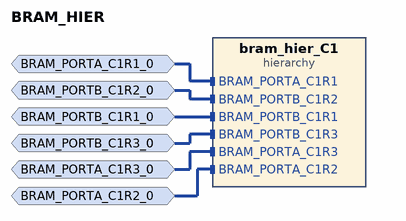
[diagram p0: block diagram of the top level]
# Vivado block design BRAM_HIER, xc7z020clg400-1, Vivado 2020.1
create_bd_design BRAM_HIER

create_bd_intf_port -mode Slave -vlnv xilinx.com:interface:bram_rtl:1.0 BRAM_PORTA_C1R1_0
set_property -dict {CONFIG.READ_WRITE_MODE READ_WRITE} [get_bd_intf_ports BRAM_PORTA_C1R1_0]
create_bd_intf_port -mode Slave -vlnv xilinx.com:interface:bram_rtl:1.0 BRAM_PORTA_C1R2_0
set_property -dict {CONFIG.READ_WRITE_MODE READ_WRITE} [get_bd_intf_ports BRAM_PORTA_C1R2_0]
create_bd_intf_port -mode Slave -vlnv xilinx.com:interface:bram_rtl:1.0 BRAM_PORTA_C1R3_0
set_property -dict {CONFIG.READ_WRITE_MODE READ_WRITE} [get_bd_intf_ports BRAM_PORTA_C1R3_0]
create_bd_intf_port -mode Slave -vlnv xilinx.com:interface:bram_rtl:1.0 BRAM_PORTB_C1R1_0
set_property -dict {CONFIG.READ_WRITE_MODE READ_WRITE} [get_bd_intf_ports BRAM_PORTB_C1R1_0]
create_bd_intf_port -mode Slave -vlnv xilinx.com:interface:bram_rtl:1.0 BRAM_PORTB_C1R2_0
set_property -dict {CONFIG.READ_WRITE_MODE READ_WRITE} [get_bd_intf_ports BRAM_PORTB_C1R2_0]
create_bd_intf_port -mode Slave -vlnv xilinx.com:interface:bram_rtl:1.0 BRAM_PORTB_C1R3_0
set_property -dict {CONFIG.READ_WRITE_MODE READ_WRITE} [get_bd_intf_ports BRAM_PORTB_C1R3_0]

create_bd_cell -type hier bram_hier_C1

# ---- hierarchy /bram_hier_C1 ----
current_bd_instance /bram_hier_C1
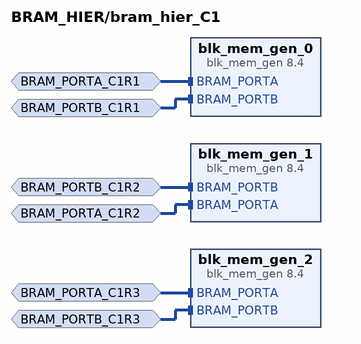
[diagram p1: block diagram inside /bram_hier_C1]
create_bd_intf_pin -mode Slave -vlnv xilinx.com:interface:bram_rtl:1.0 BRAM_PORTA_C1R1
create_bd_intf_pin -mode Slave -vlnv xilinx.com:interface:bram_rtl:1.0 BRAM_PORTB_C1R1
create_bd_intf_pin -mode Slave -vlnv xilinx.com:interface:bram_rtl:1.0 BRAM_PORTA_C1R2
create_bd_intf_pin -mode Slave -vlnv xilinx.com:interface:bram_rtl:1.0 BRAM_PORTB_C1R2
create_bd_intf_pin -mode Slave -vlnv xilinx.com:interface:bram_rtl:1.0 BRAM_PORTA_C1R3
create_bd_intf_pin -mode Slave -vlnv xilinx.com:interface:bram_rtl:1.0 BRAM_PORTB_C1R3

create_bd_cell -type ip -vlnv xilinx.com:ip:blk_mem_gen:8.4 blk_mem_gen_0
set_property -dict [list \
  CONFIG.Enable_32bit_Address false \
  CONFIG.Enable_B Use_ENB_Pin \
  CONFIG.Memory_Type True_Dual_Port_RAM \
  CONFIG.Port_B_Clock 100 \
  CONFIG.Port_B_Enable_Rate 100 \
  CONFIG.Port_B_Write_Rate 50 \
  CONFIG.Register_PortA_Output_of_Memory_Primitives true \
  CONFIG.Register_PortB_Output_of_Memory_Primitives true \
  CONFIG.Use_Byte_Write_Enable false \
  CONFIG.Use_RSTA_Pin false \
  CONFIG.Write_Depth_A 1800 \
  CONFIG.use_bram_block Stand_Alone \
] [get_bd_cells blk_mem_gen_0]
create_bd_cell -type ip -vlnv xilinx.com:ip:blk_mem_gen:8.4 blk_mem_gen_1
set_property -dict [list \
  CONFIG.Enable_32bit_Address false \
  CONFIG.Enable_B Use_ENB_Pin \
  CONFIG.Memory_Type True_Dual_Port_RAM \
  CONFIG.Port_B_Clock 100 \
  CONFIG.Port_B_Enable_Rate 100 \
  CONFIG.Port_B_Write_Rate 50 \
  CONFIG.Register_PortA_Output_of_Memory_Primitives true \
  CONFIG.Register_PortB_Output_of_Memory_Primitives true \
  CONFIG.Use_Byte_Write_Enable false \
  CONFIG.Use_RSTA_Pin false \
  CONFIG.Write_Depth_A 1800 \
  CONFIG.use_bram_block Stand_Alone \
] [get_bd_cells blk_mem_gen_1]
create_bd_cell -type ip -vlnv xilinx.com:ip:blk_mem_gen:8.4 blk_mem_gen_2
set_property -dict [list \
  CONFIG.Enable_32bit_Address false \
  CONFIG.Enable_B Use_ENB_Pin \
  CONFIG.Memory_Type True_Dual_Port_RAM \
  CONFIG.Port_B_Clock 100 \
  CONFIG.Port_B_Enable_Rate 100 \
  CONFIG.Port_B_Write_Rate 50 \
  CONFIG.Register_PortA_Output_of_Memory_Primitives true \
  CONFIG.Register_PortB_Output_of_Memory_Primitives true \
  CONFIG.Use_Byte_Write_Enable false \
  CONFIG.Use_RSTA_Pin false \
  CONFIG.Write_Depth_A 1800 \
  CONFIG.use_bram_block Stand_Alone \
] [get_bd_cells blk_mem_gen_2]

# ---- connections ----

current_bd_instance /bram_hier_C1
connect_bd_intf_net [get_bd_intf_pins BRAM_PORTA_C1R1] [get_bd_intf_pins blk_mem_gen_0/BRAM_PORTA]
connect_bd_intf_net [get_bd_intf_pins BRAM_PORTB_C1R1] [get_bd_intf_pins blk_mem_gen_0/BRAM_PORTB]
connect_bd_intf_net [get_bd_intf_pins BRAM_PORTA_C1R3] [get_bd_intf_pins blk_mem_gen_2/BRAM_PORTA]
connect_bd_intf_net [get_bd_intf_pins BRAM_PORTB_C1R3] [get_bd_intf_pins blk_mem_gen_2/BRAM_PORTB]
connect_bd_intf_net [get_bd_intf_pins BRAM_PORTB_C1R2] [get_bd_intf_pins blk_mem_gen_1/BRAM_PORTB]
connect_bd_intf_net [get_bd_intf_pins BRAM_PORTA_C1R2] [get_bd_intf_pins blk_mem_gen_1/BRAM_PORTA]

current_bd_instance /
connect_bd_intf_net -intf_net BRAM_PORTA_C1R1_0_1 [get_bd_intf_ports BRAM_PORTA_C1R1_0] [get_bd_intf_pins bram_hier_C1/BRAM_PORTA_C1R1]
connect_bd_intf_net -intf_net BRAM_PORTB_C1R2_0_1 [get_bd_intf_ports BRAM_PORTB_C1R2_0] [get_bd_intf_pins bram_hier_C1/BRAM_PORTB_C1R2]
connect_bd_intf_net -intf_net BRAM_PORTB_C1R1_0_1 [get_bd_intf_ports BRAM_PORTB_C1R1_0] [get_bd_intf_pins bram_hier_C1/BRAM_PORTB_C1R1]
connect_bd_intf_net -intf_net BRAM_PORTB_C1R3_0_1 [get_bd_intf_ports BRAM_PORTB_C1R3_0] [get_bd_intf_pins bram_hier_C1/BRAM_PORTB_C1R3]
connect_bd_intf_net -intf_net BRAM_PORTA_C1R3_0_1 [get_bd_intf_ports BRAM_PORTA_C1R3_0] [get_bd_intf_pins bram_hier_C1/BRAM_PORTA_C1R3]
connect_bd_intf_net -intf_net BRAM_PORTA_C1R2_0_1 [get_bd_intf_ports BRAM_PORTA_C1R2_0] [get_bd_intf_pins bram_hier_C1/BRAM_PORTA_C1R2]

validate_bd_design
save_bd_design
